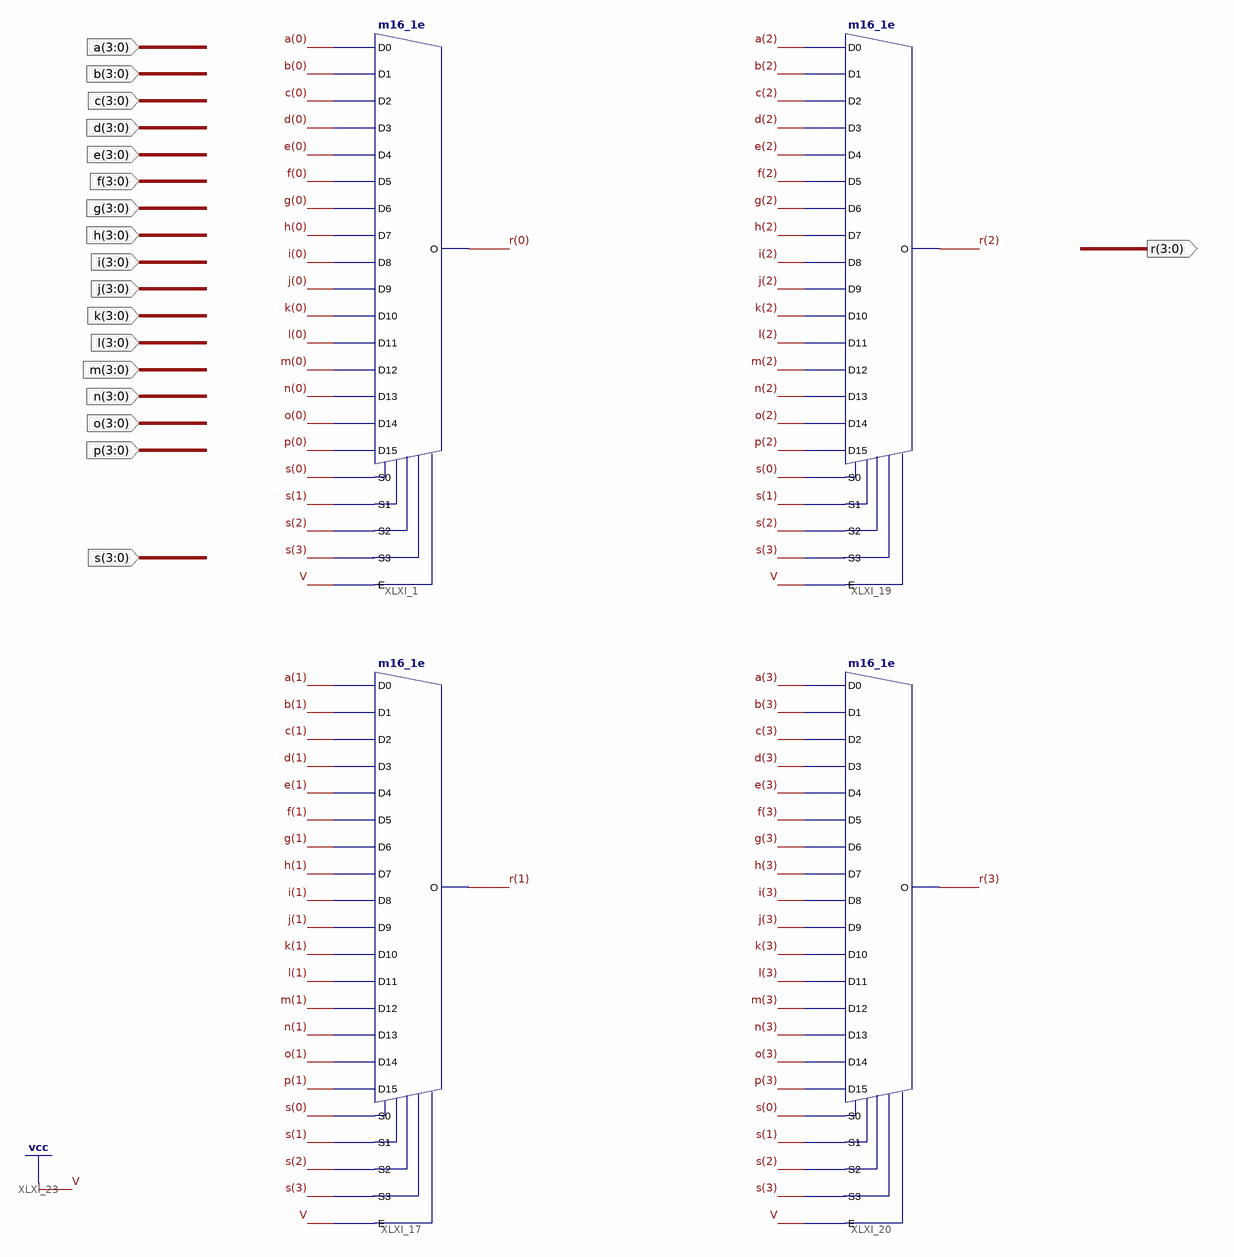
[diagram p0: schematic sheet 1]
// Xilinx ISE schematic mux4b16.sch (spartan3e) as structural Verilog: 4 symbols, 18 ports
module mux4b16 (
  input  [3:0] a,
  input  [3:0] b,
  input  [3:0] c,
  input  [3:0] d,
  input  [3:0] e,
  input  [3:0] f,
  input  [3:0] g,
  input  [3:0] h,
  input  [3:0] i,
  input  [3:0] j,
  input  [3:0] k,
  input  [3:0] l,
  input  [3:0] m,
  input  [3:0] n,
  input  [3:0] o,
  input  [3:0] p,
  input  [3:0] s,
  output [3:0] r
);

  m16_1e XLXI_1 (
    .D0(a[0]), .D1(b[0]), .D10(k[0]), .D11(l[0]), .D12(m[0]), .D13(n[0]), .D14(o[0]), .D15(p[0]), .D2(c[0]),
    .D3(d[0]), .D4(e[0]), .D5(f[0]), .D6(g[0]), .D7(h[0]), .D8(i[0]), .D9(j[0]), .E(1'b1), .S0(s[0]),
    .S1(s[1]), .S2(s[2]), .S3(s[3]), .O(r[0]));
  m16_1e XLXI_17 (
    .D0(a[1]), .D1(b[1]), .D10(k[1]), .D11(l[1]), .D12(m[1]), .D13(n[1]), .D14(o[1]), .D15(p[1]), .D2(c[1]),
    .D3(d[1]), .D4(e[1]), .D5(f[1]), .D6(g[1]), .D7(h[1]), .D8(i[1]), .D9(j[1]), .E(1'b1), .S0(s[0]),
    .S1(s[1]), .S2(s[2]), .S3(s[3]), .O(r[1]));
  m16_1e XLXI_19 (
    .D0(a[2]), .D1(b[2]), .D10(k[2]), .D11(l[2]), .D12(m[2]), .D13(n[2]), .D14(o[2]), .D15(p[2]), .D2(c[2]),
    .D3(d[2]), .D4(e[2]), .D5(f[2]), .D6(g[2]), .D7(h[2]), .D8(i[2]), .D9(j[2]), .E(1'b1), .S0(s[0]),
    .S1(s[1]), .S2(s[2]), .S3(s[3]), .O(r[2]));
  m16_1e XLXI_20 (
    .D0(a[3]), .D1(b[3]), .D10(k[3]), .D11(l[3]), .D12(m[3]), .D13(n[3]), .D14(o[3]), .D15(p[3]), .D2(c[3]),
    .D3(d[3]), .D4(e[3]), .D5(f[3]), .D6(g[3]), .D7(h[3]), .D8(i[3]), .D9(j[3]), .E(1'b1), .S0(s[0]),
    .S1(s[1]), .S2(s[2]), .S3(s[3]), .O(r[3]));
endmodule
